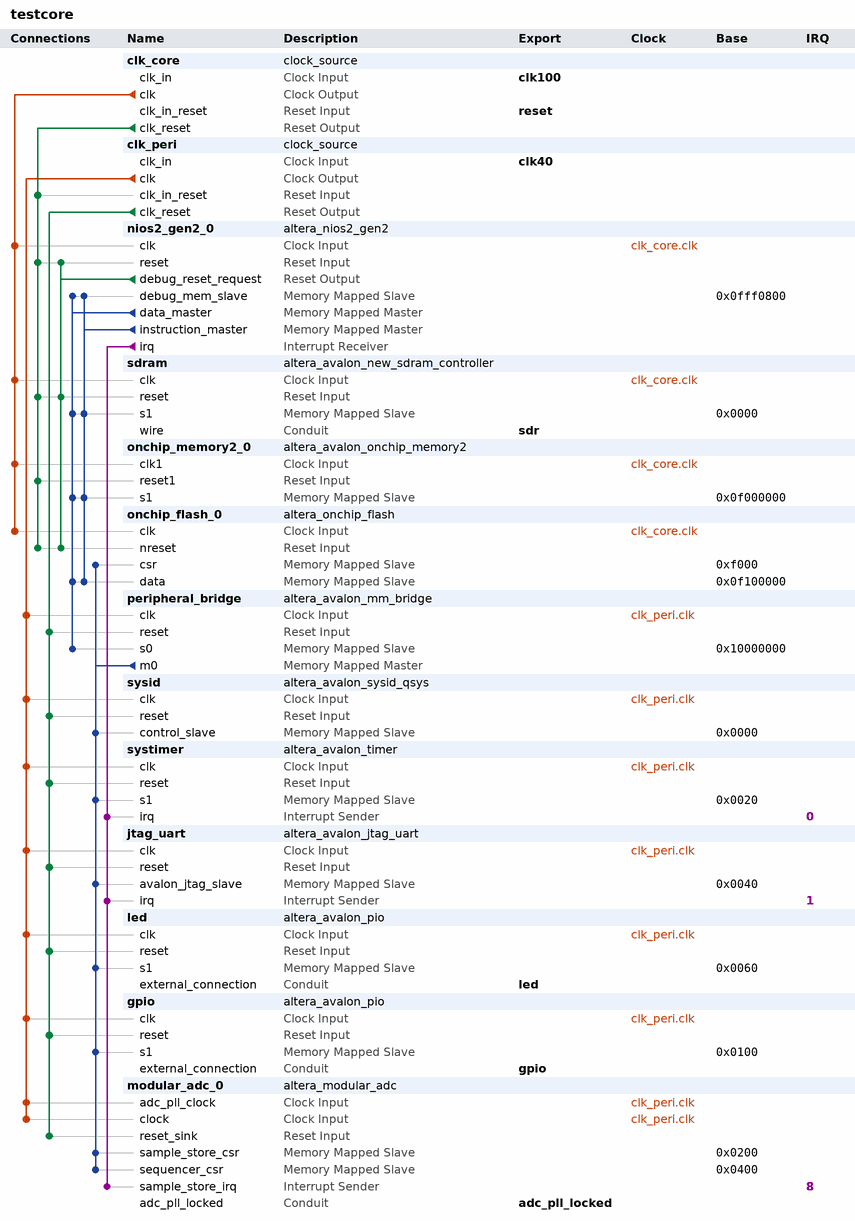
[diagram p0: system contents]
# Platform Designer (Qsys) system testcore, MAX 10 FPGA 10M08SAE144C8GES
# Parameters at their usual value, and those the tool derives, are not listed.
package require -exact qsys 14.0
create_system testcore
set_project_property DEVICE_FAMILY {MAX 10 FPGA}
set_project_property DEVICE 10M08SAE144C8GES

add_instance clk_core clock_source 14.0
set_instance_parameter_value clk_core clockFrequency 100000000

add_instance clk_peri clock_source 14.0
set_instance_parameter_value clk_peri clockFrequency 40000000

add_instance nios2_gen2_0 altera_nios2_gen2 14.0
set_instance_parameter_value nios2_gen2_0 resetSlave onchip_memory2_0.s1
set_instance_parameter_value nios2_gen2_0 exceptionSlave onchip_memory2_0.s1
set_instance_parameter_value nios2_gen2_0 setting_branchPredictionType Dynamic
set_instance_parameter_value nios2_gen2_0 impl Fast
set_instance_parameter_value nios2_gen2_0 icache_size 8192
set_instance_parameter_value nios2_gen2_0 dcache_size 4096

add_instance sdram altera_avalon_new_sdram_controller 14.0
set_instance_parameter_value sdram TAC 6.5
set_instance_parameter_value sdram TRCD 21.0
set_instance_parameter_value sdram TRFC 63.0
set_instance_parameter_value sdram TRP 21.0
set_instance_parameter_value sdram casLatency 2
set_instance_parameter_value sdram columnWidth 9
set_instance_parameter_value sdram dataWidth 16
set_instance_parameter_value sdram generateSimulationModel false
set_instance_parameter_value sdram initRefreshCommands 8
set_instance_parameter_value sdram model single_Micron_MT48LC4M32B2_7_chip
set_instance_parameter_value sdram numberOfBanks 4
set_instance_parameter_value sdram numberOfChipSelects 1
set_instance_parameter_value sdram powerUpDelay 200.0
set_instance_parameter_value sdram refreshPeriod 7.8125
set_instance_parameter_value sdram rowWidth 13

add_instance onchip_memory2_0 altera_avalon_onchip_memory2 14.0
set_instance_parameter_value onchip_memory2_0 dataWidth 32
set_instance_parameter_value onchip_memory2_0 dualPort false
set_instance_parameter_value onchip_memory2_0 initMemContent true
set_instance_parameter_value onchip_memory2_0 initializationFileName onchip_mem.hex
set_instance_parameter_value onchip_memory2_0 memorySize 16384

add_instance onchip_flash_0 altera_onchip_flash 14.0.2
set_instance_parameter_value onchip_flash_0 ACCESS_MODE {Read and write}
set_instance_parameter_value onchip_flash_0 BOOL_DUAL_BOOT false
set_instance_parameter_value onchip_flash_0 initFlashContent false
set_instance_parameter_value onchip_flash_0 useNonDefaultInitFile false
set_instance_parameter_value onchip_flash_0 initializationFileName altera_onchip_flash.hex

add_instance peripheral_bridge altera_avalon_mm_bridge 14.0
set_instance_parameter_value peripheral_bridge DATA_WIDTH 32
set_instance_parameter_value peripheral_bridge ADDRESS_WIDTH 16
set_instance_parameter_value peripheral_bridge USE_AUTO_ADDRESS_WIDTH 0
set_instance_parameter_value peripheral_bridge ADDRESS_UNITS SYMBOLS
set_instance_parameter_value peripheral_bridge MAX_PENDING_RESPONSES 1

add_instance sysid altera_avalon_sysid_qsys 14.0
set_instance_parameter_value sysid id 538186003

add_instance systimer altera_avalon_timer 14.0
set_instance_parameter_value systimer period 1
set_instance_parameter_value systimer periodUnits MSEC

add_instance jtag_uart altera_avalon_jtag_uart 14.0
set_instance_parameter_value jtag_uart simInteractiveOptions NO_INTERACTIVE_WINDOWS

add_instance led altera_avalon_pio 14.0
set_instance_parameter_value led direction Output
set_instance_parameter_value led width 1

add_instance gpio altera_avalon_pio 14.0
set_instance_parameter_value gpio direction Bidir
set_instance_parameter_value gpio width 28

add_instance modular_adc_0 altera_modular_adc 14.0
set_instance_parameter_value modular_adc_0 CORE_VAR 0
set_instance_parameter_value modular_adc_0 FAMILY {MAX 10 FPGA}
set_instance_parameter_value modular_adc_0 DEVICE_PART 10M08SAE144C8GES
set_instance_parameter_value modular_adc_0 clkdiv 4
set_instance_parameter_value modular_adc_0 tsclkdiv 1
set_instance_parameter_value modular_adc_0 refsel 1
set_instance_parameter_value modular_adc_0 int_vref_vr 3.3
set_instance_parameter_value modular_adc_0 use_tsd true
set_instance_parameter_value modular_adc_0 use_ch0 false
set_instance_parameter_value modular_adc_0 use_ch2 true
set_instance_parameter_value modular_adc_0 use_ch3 true
set_instance_parameter_value modular_adc_0 use_ch4 true
set_instance_parameter_value modular_adc_0 use_ch5 true
set_instance_parameter_value modular_adc_0 use_ch6 true
set_instance_parameter_value modular_adc_0 use_ch7 false
set_instance_parameter_value modular_adc_0 use_ch8 false
set_instance_parameter_value modular_adc_0 seq_order_length 7
set_instance_parameter_value modular_adc_0 seq_order_slot_1 1
set_instance_parameter_value modular_adc_0 seq_order_slot_2 2
set_instance_parameter_value modular_adc_0 seq_order_slot_3 3
set_instance_parameter_value modular_adc_0 seq_order_slot_4 4
set_instance_parameter_value modular_adc_0 seq_order_slot_5 5
set_instance_parameter_value modular_adc_0 seq_order_slot_6 6
set_instance_parameter_value modular_adc_0 seq_order_slot_7 17

# connections
add_connection clk_core.clk nios2_gen2_0.clk clock
add_connection clk_core.clk onchip_flash_0.clk clock
add_connection clk_core.clk onchip_memory2_0.clk1 clock
add_connection clk_core.clk sdram.clk clock
add_connection clk_peri.clk gpio.clk clock
add_connection clk_peri.clk jtag_uart.clk clock
add_connection clk_peri.clk led.clk clock
add_connection clk_peri.clk modular_adc_0.adc_pll_clock clock
add_connection clk_peri.clk modular_adc_0.clock clock
add_connection clk_peri.clk peripheral_bridge.clk clock
add_connection clk_peri.clk sysid.clk clock
add_connection clk_peri.clk systimer.clk clock
add_connection clk_core.clk_reset clk_peri.clk_in_reset reset
add_connection clk_core.clk_reset nios2_gen2_0.reset reset
add_connection clk_core.clk_reset onchip_flash_0.nreset reset
add_connection clk_core.clk_reset onchip_memory2_0.reset1 reset
add_connection clk_core.clk_reset sdram.reset reset
add_connection clk_peri.clk_reset gpio.reset reset
add_connection clk_peri.clk_reset jtag_uart.reset reset
add_connection clk_peri.clk_reset led.reset reset
add_connection clk_peri.clk_reset modular_adc_0.reset_sink reset
add_connection clk_peri.clk_reset peripheral_bridge.reset reset
add_connection clk_peri.clk_reset sysid.reset reset
add_connection clk_peri.clk_reset systimer.reset reset
add_connection nios2_gen2_0.debug_reset_request nios2_gen2_0.reset reset
add_connection nios2_gen2_0.debug_reset_request onchip_flash_0.nreset reset
add_connection nios2_gen2_0.debug_reset_request sdram.reset reset
add_connection nios2_gen2_0.data_master nios2_gen2_0.debug_mem_slave avalon
set_connection_parameter_value nios2_gen2_0.data_master/nios2_gen2_0.debug_mem_slave baseAddress 0x0fff0800
add_connection nios2_gen2_0.data_master onchip_flash_0.data avalon
set_connection_parameter_value nios2_gen2_0.data_master/onchip_flash_0.data baseAddress 0x0f100000
add_connection nios2_gen2_0.data_master onchip_memory2_0.s1 avalon
set_connection_parameter_value nios2_gen2_0.data_master/onchip_memory2_0.s1 baseAddress 0x0f000000
add_connection nios2_gen2_0.data_master peripheral_bridge.s0 avalon
set_connection_parameter_value nios2_gen2_0.data_master/peripheral_bridge.s0 baseAddress 0x10000000
add_connection nios2_gen2_0.data_master sdram.s1 avalon
set_connection_parameter_value nios2_gen2_0.data_master/sdram.s1 baseAddress 0x0000
add_connection nios2_gen2_0.instruction_master nios2_gen2_0.debug_mem_slave avalon
set_connection_parameter_value nios2_gen2_0.instruction_master/nios2_gen2_0.debug_mem_slave baseAddress 0x0fff0800
add_connection nios2_gen2_0.instruction_master onchip_flash_0.data avalon
set_connection_parameter_value nios2_gen2_0.instruction_master/onchip_flash_0.data baseAddress 0x0f100000
add_connection nios2_gen2_0.instruction_master onchip_memory2_0.s1 avalon
set_connection_parameter_value nios2_gen2_0.instruction_master/onchip_memory2_0.s1 baseAddress 0x0f000000
add_connection nios2_gen2_0.instruction_master sdram.s1 avalon
set_connection_parameter_value nios2_gen2_0.instruction_master/sdram.s1 baseAddress 0x0000
add_connection peripheral_bridge.m0 gpio.s1 avalon
set_connection_parameter_value peripheral_bridge.m0/gpio.s1 baseAddress 0x0100
add_connection peripheral_bridge.m0 jtag_uart.avalon_jtag_slave avalon
set_connection_parameter_value peripheral_bridge.m0/jtag_uart.avalon_jtag_slave baseAddress 0x0040
add_connection peripheral_bridge.m0 led.s1 avalon
set_connection_parameter_value peripheral_bridge.m0/led.s1 baseAddress 0x0060
add_connection peripheral_bridge.m0 modular_adc_0.sample_store_csr avalon
set_connection_parameter_value peripheral_bridge.m0/modular_adc_0.sample_store_csr baseAddress 0x0200
add_connection peripheral_bridge.m0 modular_adc_0.sequencer_csr avalon
set_connection_parameter_value peripheral_bridge.m0/modular_adc_0.sequencer_csr baseAddress 0x0400
add_connection peripheral_bridge.m0 onchip_flash_0.csr avalon
set_connection_parameter_value peripheral_bridge.m0/onchip_flash_0.csr baseAddress 0xf000
add_connection peripheral_bridge.m0 sysid.control_slave avalon
set_connection_parameter_value peripheral_bridge.m0/sysid.control_slave baseAddress 0x0000
add_connection peripheral_bridge.m0 systimer.s1 avalon
set_connection_parameter_value peripheral_bridge.m0/systimer.s1 baseAddress 0x0020
add_connection nios2_gen2_0.irq jtag_uart.irq interrupt
set_connection_parameter_value nios2_gen2_0.irq/jtag_uart.irq irqNumber 1
add_connection nios2_gen2_0.irq modular_adc_0.sample_store_irq interrupt
set_connection_parameter_value nios2_gen2_0.irq/modular_adc_0.sample_store_irq irqNumber 8
add_connection nios2_gen2_0.irq systimer.irq interrupt
set_connection_parameter_value nios2_gen2_0.irq/systimer.irq irqNumber 0

# exported interfaces
add_interface clk100 clock sink
set_interface_property clk100 EXPORT_OF clk_core.clk_in
add_interface reset reset sink
set_interface_property reset EXPORT_OF clk_core.clk_in_reset
add_interface led conduit end
set_interface_property led EXPORT_OF led.external_connection
add_interface gpio conduit end
set_interface_property gpio EXPORT_OF gpio.external_connection
add_interface clk40 clock sink
set_interface_property clk40 EXPORT_OF clk_peri.clk_in
add_interface sdr conduit end
set_interface_property sdr EXPORT_OF sdram.wire
add_interface adc_pll_locked conduit end
set_interface_property adc_pll_locked EXPORT_OF modular_adc_0.adc_pll_locked

set_interconnect_requirement {$system} qsys_mm.clockCrossingAdapter HANDSHAKE
set_interconnect_requirement {$system} qsys_mm.maxAdditionalLatency 1
set_interconnect_requirement {$system} qsys_mm.insertDefaultSlave FALSE

save_system testcore.qsys
